# EasyEDA Pro project ProPrj_承载我所有幻想的键盘_2025-02-09.epro, schematic 02-Schematic
Create Date: 2022-10-28; Page Name: P1; Project Name: 火星号键盘V2; Schematic Name: Schematic3_1; Update Date: 2022-12-06; Company: 嘉立创EDA; Page Size: A4; Version: V1.0
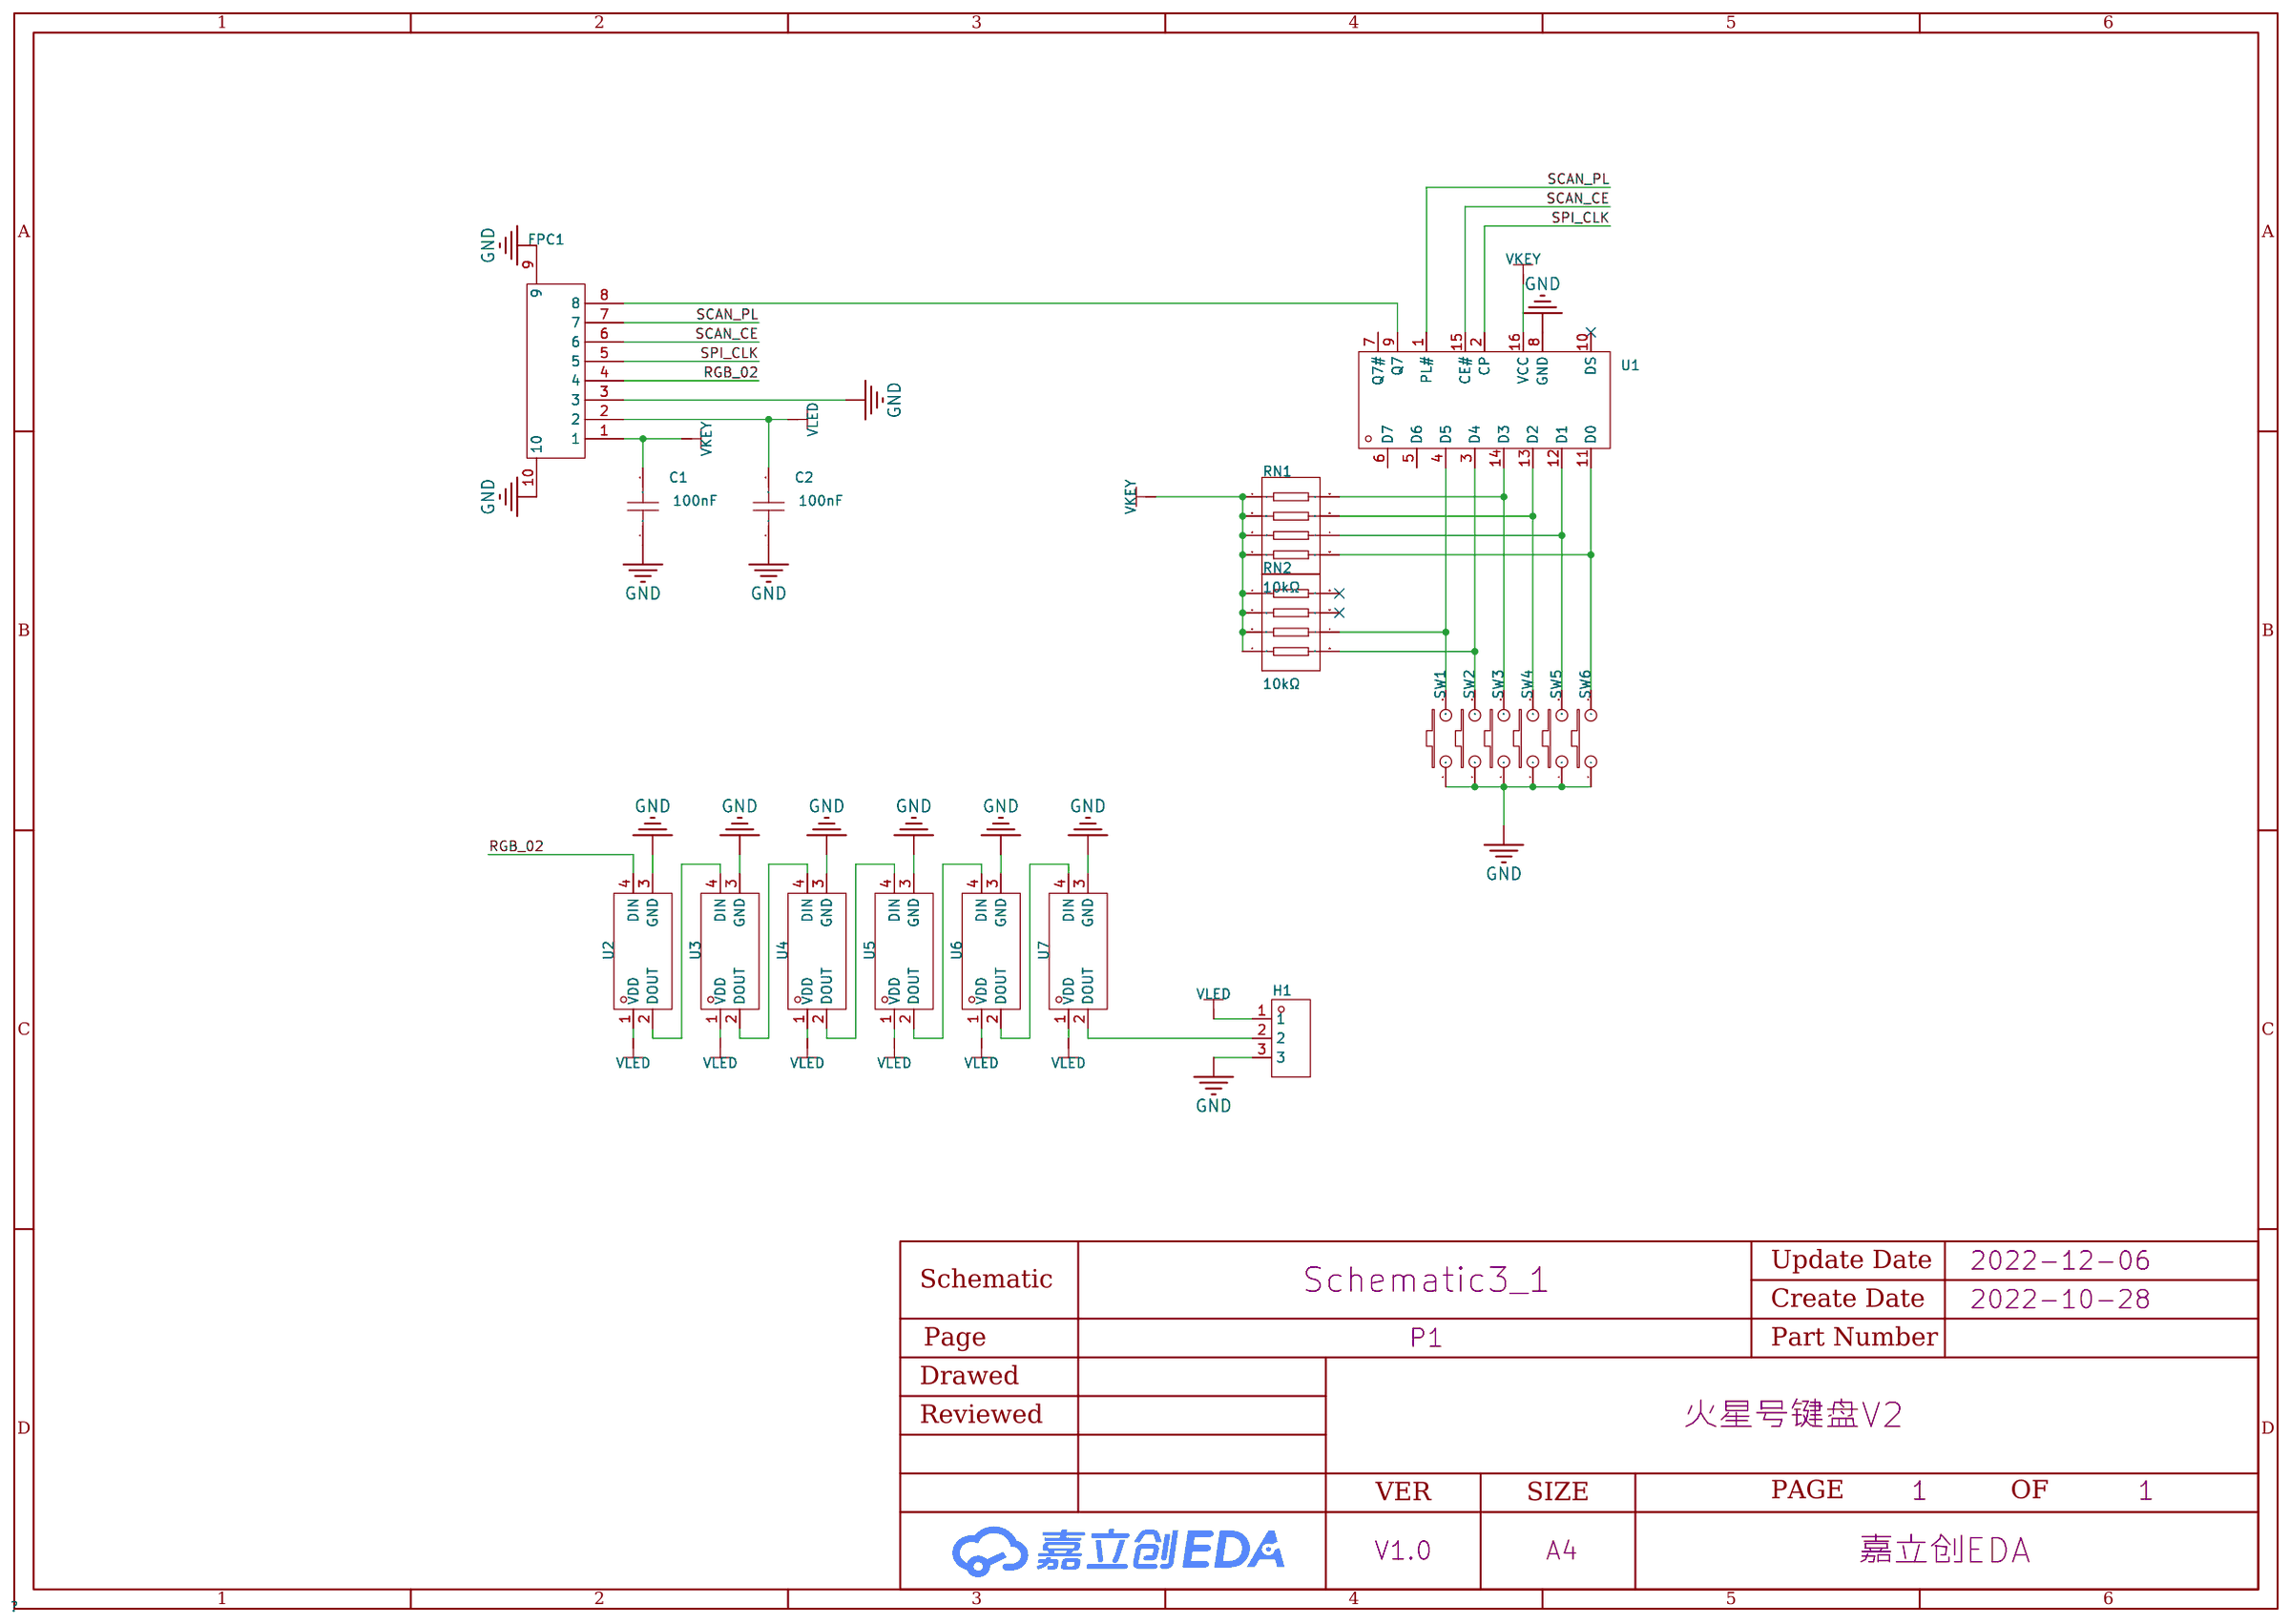
[diagram p8: schematic sheet]

## Parts
C1  100nF  [C0603]
C2  100nF  [C0603]
FPC1  -  [FPC-SMD_P0.50-8P_FGS-XJ-H2.0]
H1  -  [HDR-TH_3P-P2.54-V-M]
RN1  10kΩ  [RES-ARRAY-SMD_0603-8P-L3.2-W1.6-BL]
RN2  10kΩ  [RES-ARRAY-SMD_0603-8P-L3.2-W1.6-BL]
SW1  -  [轴座_焊接热插拔_不带灯]
SW2  -  [轴座_焊接热插拔_不带灯]
SW3  -  [轴座_焊接热插拔_不带灯]
SW4  -  [轴座_焊接热插拔_不带灯]
SW5  -  [轴座_焊接热插拔_不带灯]
SW6  -  [轴座_焊接热插拔_不带灯]
U1  -  [SOIC-16_L9.9-W3.9-P1.27-LS6.0-BL]
U2  Yo-WS2812B-3528反贴雾状  [LED-SMD_L3.2-W2.8-BR_DY-S352818]
U3  Yo-WS2812B-3528反贴雾状  [LED-SMD_L3.2-W2.8-BR_DY-S352818]
U4  Yo-WS2812B-3528反贴雾状  [LED-SMD_L3.2-W2.8-BR_DY-S352818]
U5  Yo-WS2812B-3528反贴雾状  [LED-SMD_L3.2-W2.8-BR_DY-S352818]
U6  Yo-WS2812B-3528反贴雾状  [LED-SMD_L3.2-W2.8-BR_DY-S352818]
U7  Yo-WS2812B-3528反贴雾状  [LED-SMD_L3.2-W2.8-BR_DY-S352818]

## Library data of the parts
C1 C2 = CAP_0603: Supplier Footprint: 0603
FPC1 = AFC01-S08FCA-00: 间距:0.5mm;触点数量:8;锁定特性:翻盖式;安装类型:卧贴;触点类型:下接;; LCSC Part Name: 0.5mm P数:8 翻盖式 下接; Supplier Part: C262657; Manufacturer: JS(钜硕电子); Supplier Footprint: SMD,P=0.5mm; Datasheet: https://atta.szlcsc.com/upload/public/pdf/source/20180814/C262657_E4DDBFDEF95394073062C4B6399AAD54.pdf; Supplier: LCSC; Pitch: 0.5mm; Number of Contacts: 8; Locking Feature: 翻盖式; Mounting Type: 卧贴; Contact Type: 下接; Height Above Board: 2mm; FFC, FCB Thickness: 0.3mm
H1 = HDR-M_2.54_1x3P: Supplier Part: C2937625; Supplier Footprint: 插件
RN1 RN2 = 4D03WGJ0103T5E: 阻值:10kΩ;精度:±5%;单个元件功率:62.5mW;温度系数:±200ppm/;电阻器数:4;引脚数:8;; LCSC Part Name: 10kΩ ±5%; Supplier Part: C29718; Manufacturer: UNI-ROYAL(厚声); Supplier Footprint: 0603x4; Datasheet: https://atta.szlcsc.com/upload/public/pdf/source/20170615/1497511005633.pdf; Supplier: LCSC; Tolerance: ±5%; Power(Watts): 62.5mW; Temperature Coefficient: ±200ppm/; Number of Resistors: 4; Number of Pins: 8
SW1-SW6 = KEYBOARD-SW: Origin Footprint 2: MX-KEY
U1 = 74HC165D,653: Supplier Part: C5613; Manufacturer: Nexperia(安世); Supplier Footprint: SOIC-16_150mil; Datasheet: https://atta.szlcsc.com/upload/public/pdf/source/20160218/1457707760975.pdf; Supplier: LCSC
U2-U7 = YO-WS2812B-3528反贴: Supplier: LCSC; Supplier Part: C9900003682; Manufacturer: null

## Nets
GND: C1.1 C2.1 FPC1.3 FPC1.9 FPC1.10 H1.3 SW1.1 SW2.1 SW3.1 SW4.1 SW5.1 SW6.1 U1.8(GND) U2.3(GND) U3.3(GND) U4.3(GND) U5.3(GND) U6.3(GND) U7.3(GND)
RGB_02: FPC1.4 U2.4(DIN)
SCAN_CE: FPC1.6 U1.15(CE#)
SCAN_PL: FPC1.7 U1.1(PL#)
SPI_CLK: FPC1.5 U1.2(CP)
VKEY: C1.2 FPC1.1 RN1.1 RN1.2 RN1.3 RN1.4 RN2.1 RN2.2 RN2.3 RN2.4 U1.16(VCC)
VLED: C2.2 FPC1.2 H1.1 U2.1(VDD) U3.1(VDD) U4.1(VDD) U5.1(VDD) U6.1(VDD) U7.1(VDD)
$1N273: FPC1.8 U1.9(Q7)
$1N872: RN2.7 SW1.2 U1.4(D5)
$1N873: RN2.8 SW2.2 U1.3(D4)
$1N874: RN1.5 SW3.2 U1.14(D3)
$1N875: RN1.6 SW4.2 U1.13(D2)
$1N883: RN1.8 SW6.2 U1.11(D0)
$1N884: RN1.7 SW5.2 U1.12(D1)
$1N2974: U2.2(DOUT) U3.4(DIN)
$1N2977: U3.2(DOUT) U4.4(DIN)
$1N2981: U4.2(DOUT) U5.4(DIN)
$1N2983: U5.2(DOUT) U6.4(DIN)
$1N2987: U6.2(DOUT) U7.4(DIN)
$1N5065: H1.2 U7.2(DOUT)

Not connected (* = marked no-connect by the designer): RN2 5* 6*; U1 5(D6) 6(D7) 7(Q7#) 10(DS)*
